# Altium schematic sheet STM32_PLC.SchDoc: STM32_PLC
size 420 x 297 mm; Date: March 14; CheckedBy: ThS. Bùi Quốc Bảo; DrawnBy: Nguyễn Gia Huy; Revision: V1.0; SheetNumber: 3; SheetTotal: 11; MasterProject: STM32-PLC; Sub-system: DA1_prj.PrjPcb
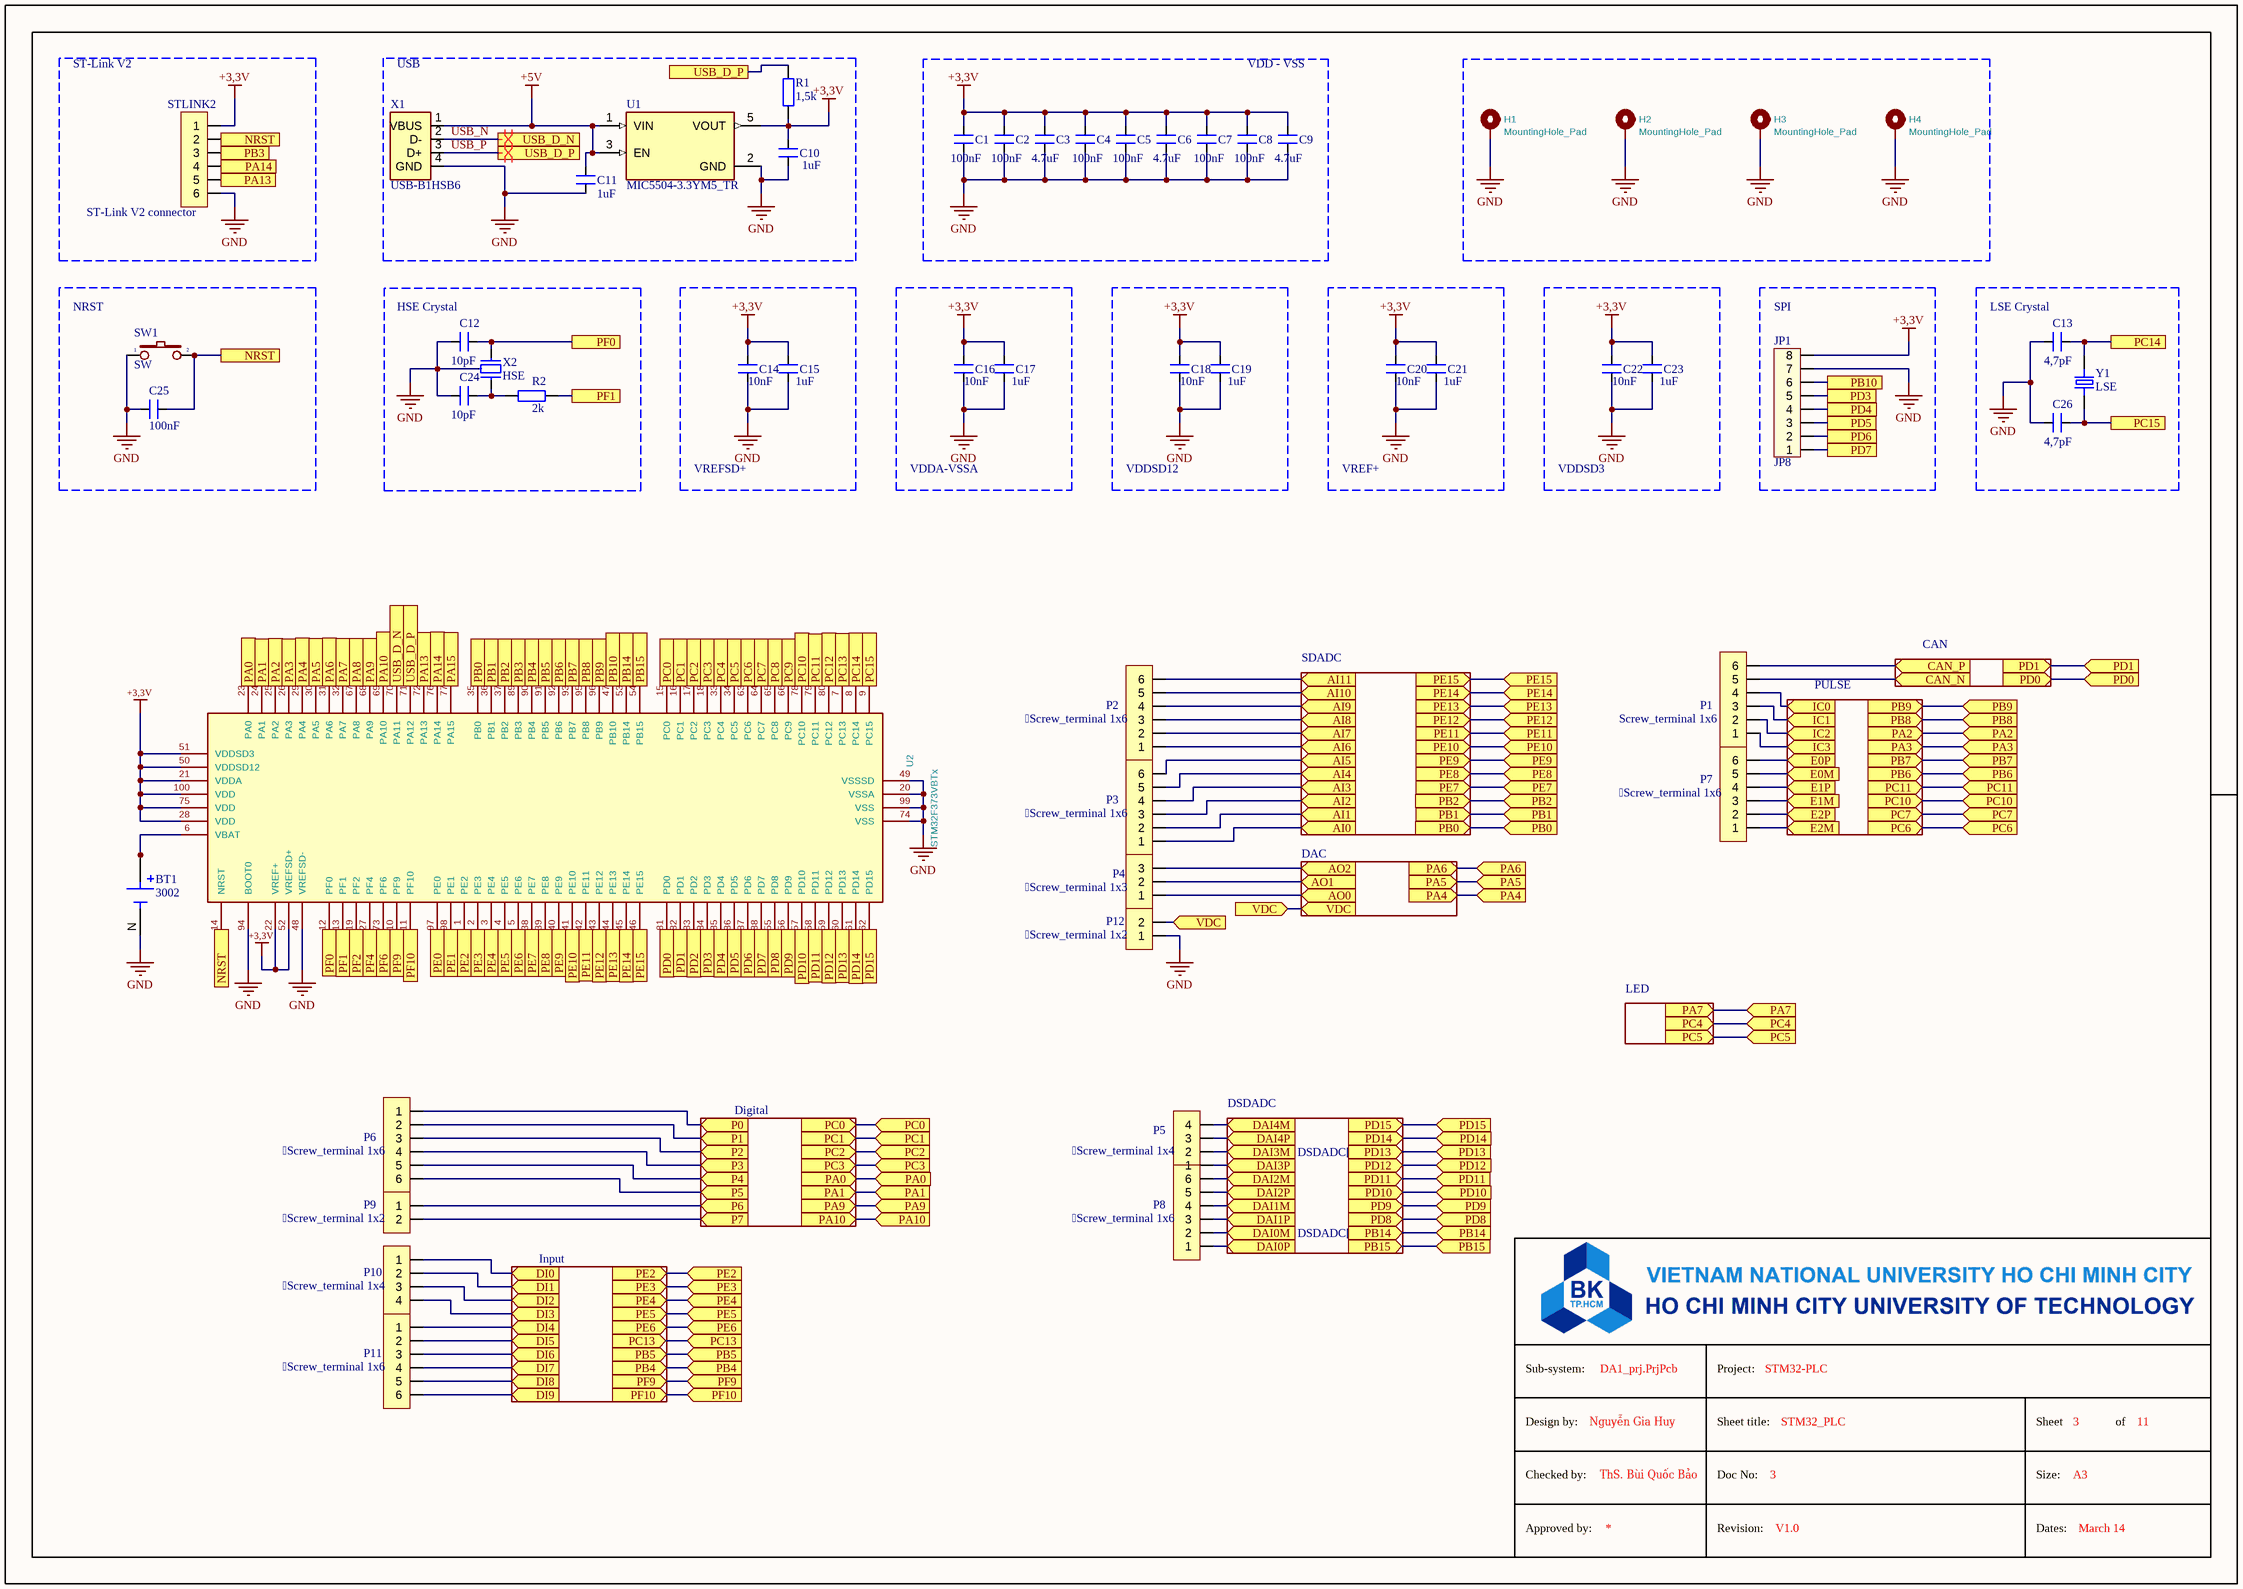
[diagram p0: STM32_PLC.SchDoc]

## Parts
BT1  3002  [BAT_3002]
C1  100nF  [FP-C0603C-CF-IPC_A]
C2  100nF  [FP-C0603C-CF-IPC_A]
C3  4.7uF  [FP-C0603C-CF-IPC_A]
C4  100nF  [FP-C0603C-CF-IPC_A]
C5  100nF  [FP-C0603C-CF-IPC_A]
C6  4.7uF  [FP-C0603C-CF-IPC_A]
C7  100nF  [FP-C0603C-CF-IPC_A]
C8  100nF  [FP-C0603C-CF-IPC_A]
C9  4.7uF  [FP-C0603C-CF-IPC_A]
C10  1uF  [FP-C0603C-CF-IPC_A]
C11  1uF  [FP-C0603C-CF-IPC_A]
C12  10pF  [FP-C0603C-CF-IPC_A]
C13  4,7pF  [FP-C0603C-CF-IPC_A]
C14  10nF  [FP-C0603C-CF-IPC_A]
C15  1uF  [FP-C0603C-CF-IPC_A]
C16  10nF  [FP-C0603C-CF-IPC_A]
C17  1uF  [FP-C0603C-CF-IPC_A]
C18  10nF  [FP-C0603C-CF-IPC_A]
C19  1uF  [FP-C0603C-CF-IPC_A]
C20  10nF  [FP-C0603C-CF-IPC_A]
C21  1uF  [FP-C0603C-CF-IPC_A]
C22  10nF  [FP-C0603C-CF-IPC_A]
C23  1uF  [FP-C0603C-CF-IPC_A]
C24  10pF  [FP-C0603C-CF-IPC_A]
C25  100nF  [FP-C0603C-CF-IPC_A]
C26  4,7pF  [FP-C0603C-CF-IPC_A]
H1  MountingHole_Pad  [MountingHole_2.7mm_M2.5_DIN965_Pad]
H2  MountingHole_Pad  [MountingHole_2.7mm_M2.5_DIN965_Pad]
H3  MountingHole_Pad  [MountingHole_2.7mm_M2.5_DIN965_Pad]
H4  MountingHole_Pad  [MountingHole_2.7mm_M2.5_DIN965_Pad]
JP1  JP8  [HDR/Header/8]
P1  Screw_terminal 1x6  [HDR/Terminal/6]
P2  Screw_terminal 1x6  [HDR/Terminal/6]
P3  Screw_terminal 1x6  [HDR/Terminal/6]
P4  Screw_terminal 1x3  [HDR/Terminal/3]
P5  Screw_terminal 1x4  [HDR/Terminal/4]
P6  Screw_terminal 1x6  [HDR/Terminal/6]
P7  Screw_terminal 1x6  [HDR/Terminal/6]
P8  Screw_terminal 1x6  [HDR/Terminal/6]
P9  Screw_terminal 1x2  [HDR/Terminal/2]
P10  Screw_terminal 1x4  [HDR/Terminal/4]
P11  Screw_terminal 1x6  [HDR/Terminal/6]
P12  Screw_terminal 1x2  [HDR/Terminal/2]
R1  1,5k  [tro smd 0603]
R2  2k  [tro smd 0603]
STLINK2  ST-Link V2 connector  [HDR/Header/6]
SW1  SW  [SW1-SMD]
U1  MIC5504-3.3YM5_TR  [SOT95P280X145-5N]
U2  STM32F373VBTx  [QFP50P1600X1600X160-100N]
X1  USB-B1HSB6  [OST_USB-B1HSB6]
X2  HSE  [XT3]
Y1  LSE  [XTAL_ECS-.327-7-34B-TR]

## Blocks framed on the sheet
ST-Link V2: STLINK2
USB: C10 C11 R1 U1 X1
VDD - VSS: C1-C9
NRST: C25 SW1
HSE Crystal: C12 C24 R2 X2
VREFSD+: C14 C15
VDDA-VSSA: C16 C17
VDDSD12: C18 C19
VREF+: C20 C21
VDDSD3: C22 C23
SPI: JP1
LSE Crystal: C13 C26 Y1

## Ports
AI0 (in, see SDADC[4C]), AI1 (in, see SDADC[4B]), AI2 (in, see SDADC[4B]), AI3 (in, see SDADC[4A]), AI4 (in, see SDADC[3C]), AI5 (in, see SDADC[3B]), AI6 (in, see SDADC[3B]), AI7 (in, see SDADC[3A]), AI8 (in, see SDADC[1C]), AI9 (in, see SDADC[1B]), AI10 (in, see SDADC[1B]), AI11 (in, see SDADC[1A]), AO0 (in, see DAC[3B]), AO1 (in, see DAC[3D]), AO2 (in, see DAC[5B]), CAN_N (in, see CAN[4B]), CAN_P (in, see CAN[4B]), DAI0M (in, see DSDADC[4B]), DAI0P (in, see DSDADC[4A]), DAI1M (in, see DSDADC[3C]), DAI1P (in, see DSDADC[3C]), DAI2M (in, see DSDADC[3A]), DAI2P (in, see DSDADC[3B]), DAI3M (in, see DSDADC[2C]), DAI3P (in, see DSDADC[2C]), DAI4M (in, see DSDADC[2A]), DAI4P (in, see DSDADC[2B]), DI0 (in, see INPUT[1C], INPUT[3D]), DI1 (in, see INPUT[1C], INPUT[3C]), DI2 (in, see INPUT[1C], INPUT[3B]), DI3 (in, see INPUT[1C], INPUT[3B]), DI4 (in, see INPUT[1B], INPUT[3A]), DI5 (in, see INPUT[1B], INPUT[2D]), DI6 (in, see INPUT[1B], INPUT[2C]), DI7 (in, see INPUT[1B], INPUT[2B]), DI8 (in, see INPUT[1B], INPUT[2B]), DI9 (in, see INPUT[1B], INPUT[2A]), E0M (in, see PULSE[3B]), E0P (in, see PULSE[3A]), E1M (in, see PULSE[3C]), E1P (in, see PULSE[3C]), E2M (in, see PULSE[5B]), E2P (in, see PULSE[5A]), IC0 (in, see PULSE[1A]), IC1 (in, see PULSE[1B]), IC2 (in, see PULSE[1C]), IC3 (in, see PULSE[1C]), NRST (in, see STM32_PLC[1A]), NRST (see STM32_PLC[1A], STM32_PLC[1C]), P0 (in, see DIGTITAL[2A]), P1 (in, see DIGTITAL[4B]), P2 (in, see DIGTITAL[4B]), P3 (in, see DIGTITAL[2B]), P4 (in, see DIGTITAL[2B]), P5 (in, see DIGTITAL[5A]), P6 (in, see DIGTITAL[4A]), P7 (in, see DIGTITAL[5B]), PA0 (in, see DIGTITAL[1C], STM32_PLC[1B], STM32_PLC[3C]), PA0 (in, see DIGTITAL[1C], STM32_PLC[3C]), PA1 (in, see DIGTITAL[4A], STM32_PLC[1B], STM32_PLC[3D]), PA1 (in, see DIGTITAL[4A], STM32_PLC[3D]), PA2 (in, see PULSE[2C], STM32_PLC[1B], STM32_PLC[6B]), PA2 (in, see PULSE[2C], STM32_PLC[6B]), PA3 (in, see PULSE[2C], STM32_PLC[1B], STM32_PLC[6B]), PA3 (in, see PULSE[2C], STM32_PLC[6B]), PA4 (in, see DAC[2B], STM32_PLC[1B], STM32_PLC[4C]), PA4 (in, see DAC[2B], STM32_PLC[4C]), PA5 (in, see DAC[2C], STM32_PLC[1B], STM32_PLC[4C]), PA5 (in, see DAC[2C], STM32_PLC[4C]), PA6 (in, see DAC[4B], STM32_PLC[1B], STM32_PLC[4C]), PA6 (in, see DAC[4B], STM32_PLC[4C]), PA7 (in, see LED[3B], STM32_PLC[1B], STM32_PLC[5C]), PA7 (in, see LED[3B], STM32_PLC[5C]), PA8 (in), PA9 (in, see DIGTITAL[3A], STM32_PLC[1B], STM32_PLC[3D]), PA9 (in, see DIGTITAL[3A], STM32_PLC[3D]), PA10 (in, see DIGTITAL[4B], STM32_PLC[2B], STM32_PLC[3D]), PA10 (in, see DIGTITAL[4B], STM32_PLC[3D]), PA13 (in, see STM32_PLC[1A]), PA13 (see STM32_PLC[2B]), PA14 (in, see STM32_PLC[1A]), PA14 (see STM32_PLC[2B]), PA15 (in), PB0 (in, see SDADC[5C], STM32_PLC[2B], STM32_PLC[4C]), PB0 (in, see SDADC[5C], STM32_PLC[2B], STM32_PLC[5C]), PB0 (in, see SDADC[5C], STM32_PLC[4C], STM32_PLC[5C]), PB1 (in, see SDADC[5B], STM32_PLC[2B], STM32_PLC[4C]), PB1 (in, see SDADC[5B], STM32_PLC[2B], STM32_PLC[5C]), PB1 (in, see SDADC[5B], STM32_PLC[4C], STM32_PLC[5C]), PB2 (in, see SDADC[5B], STM32_PLC[2B], STM32_PLC[4C]), PB2 (in, see SDADC[5B], STM32_PLC[2B], STM32_PLC[5C]), PB2 (in, see SDADC[5B], STM32_PLC[4C], STM32_PLC[5C]), PB3 (in, see STM32_PLC[1A]), PB3 (see STM32_PLC[2B]), PB4 (in, see INPUT[3B], STM32_PLC[2B], STM32_PLC[2D]), PB4 (in, see INPUT[3B], STM32_PLC[2D]), PB5 (in, see INPUT[3C], STM32_PLC[2B], STM32_PLC[2D]), PB5 (in, see INPUT[3C], STM32_PLC[2D]), PB6 (in, see PULSE[4B], STM32_PLC[2B], STM32_PLC[6B]), PB6 (in, see PULSE[4B], STM32_PLC[6B]), PB7 (in, see PULSE[4A], STM32_PLC[2B], STM32_PLC[6B]), PB7 (in, see PULSE[4A], STM32_PLC[6B]), PB8 (in, see PULSE[2B], STM32_PLC[2B], STM32_PLC[6B]), PB8 (in, see PULSE[2B], STM32_PLC[6B]), PB9 (in, see PULSE[2A], STM32_PLC[2B], STM32_PLC[6B]), PB9 (in, see PULSE[2A], STM32_PLC[6B]), PB10 (in, see STM32_PLC[5A]), PB10 (see STM32_PLC[2B]), PB14 (in, see DSDADC[5A], STM32_PLC[2B], STM32_PLC[4D]), PB14 (in, see DSDADC[5A], STM32_PLC[4D]), PB15 (in, see DSDADC[5B], STM32_PLC[2B], STM32_PLC[4D]), PB15 (in, see DSDADC[5B], STM32_PLC[4D]), PC0 (in, see DIGTITAL[1A], STM32_PLC[2B], STM32_PLC[3C]), PC0 (in, see DIGTITAL[1A], STM32_PLC[3C]), PC1 (in, see DIGTITAL[3B], STM32_PLC[2B], STM32_PLC[3C]), PC1 (in, see DIGTITAL[3B], STM32_PLC[3C]), PC2 (in, see DIGTITAL[3C], STM32_PLC[2B], STM32_PLC[3C]), PC2 (in, see DIGTITAL[3C], STM32_PLC[3C]), PC3 (in, see DIGTITAL[1B], STM32_PLC[2B], STM32_PLC[3C]), PC3 (in, see DIGTITAL[1B], STM32_PLC[3C]), PC4 (in, see LED[3B], STM32_PLC[2B], STM32_PLC[5C]), PC4 (in, see LED[3B], STM32_PLC[5C]), PC5 (in, see LED[3C], STM32_PLC[2B], STM32_PLC[5C]), PC5 (in, see LED[3C], STM32_PLC[5C]), PC6 (in, see PULSE[6B], STM32_PLC[2B], STM32_PLC[6C]), PC6 (in, see PULSE[6B], STM32_PLC[6C]), PC7 (in, see PULSE[6A], STM32_PLC[3B], STM32_PLC[6C]), PC7 (in, see PULSE[6A], STM32_PLC[6C]), PC8 (in), PC9 (in), PC10 (in, see PULSE[4C], STM32_PLC[3B], STM32_PLC[6C]), PC10 (in, see PULSE[4C], STM32_PLC[6C]), PC11 (in, see PULSE[4C], STM32_PLC[3B], STM32_PLC[6B]), PC11 (in, see PULSE[4C], STM32_PLC[6B]), PC12 (in), PC13 (in, see INPUT[3D], STM32_PLC[2D]), PC13 (in, see INPUT[3D], STM32_PLC[2D], STM32_PLC[3B]), PC14 (in, see STM32_PLC[6A]), PC14 (see STM32_PLC[3B]), PC15 (in, see STM32_PLC[6B]), PC15 (see STM32_PLC[3B]), PD0 (in, see CAN[2C], STM32_PLC[2C], STM32_PLC[6B]), PD0 (in, see CAN[2C], STM32_PLC[6B]), PD1 (in, see CAN[2C], STM32_PLC[2C], STM32_PLC[6B]), PD1 (in, see CAN[2C], STM32_PLC[6B]), PD2 (in), PD3 (in, see STM32_PLC[5A]), PD3 (see STM32_PLC[2C]), PD4 (in, see STM32_PLC[5B]), PD4 (see STM32_PLC[2C]), PD5 (in, see STM32_PLC[5B]), PD5 (see STM32_PLC[2C]), PD6 (in, see STM32_PLC[5B]), PD6 (see STM32_PLC[2C]), PD7 (in, see STM32_PLC[5B]), PD7 (see STM32_PLC[3C]), PD8 (in, see DSDADC[4C], STM32_PLC[3C], STM32_PLC[4D]), PD8 (in, see DSDADC[4C], STM32_PLC[4D]), PD9 (in, see DSDADC[4C], STM32_PLC[3C], STM32_PLC[4D]), PD9 (in, see DSDADC[4C], STM32_PLC[4D]), PD10 (in, see DSDADC[4B], STM32_PLC[3C], STM32_PLC[4D]), PD10 (in, see DSDADC[4B], STM32_PLC[4D]), PD11 (in, see DSDADC[4A], STM32_PLC[3C], STM32_PLC[4C]), PD11 (in, see DSDADC[4A], STM32_PLC[4C]), PD12 (in, see DSDADC[2C], STM32_PLC[3C], STM32_PLC[4C]), PD12 (in, see DSDADC[2C], STM32_PLC[4C]), PD13 (in, see DSDADC[2C], STM32_PLC[3C], STM32_PLC[4C]), PD13 (in, see DSDADC[2C], STM32_PLC[4C]), PD14 (in, see DSDADC[2B], STM32_PLC[3C], STM32_PLC[4C]), PD14 (in, see DSDADC[2B], STM32_PLC[4C]), PD15 (in, see DSDADC[2A], STM32_PLC[3C], STM32_PLC[4C]), PD15 (in, see DSDADC[2A], STM32_PLC[4C]), PE0 (in), PE1 (in), PE2 (in, see INPUT[4D], STM32_PLC[2C], STM32_PLC[2D]), PE2 (in, see INPUT[4D], STM32_PLC[2D]), PE3 (in, see INPUT[4C], STM32_PLC[2C], STM32_PLC[2D]), PE3 (in, see INPUT[4C], STM32_PLC[2D]), PE4 (in, see INPUT[4B], STM32_PLC[2C], STM32_PLC[2D]), PE4 (in, see INPUT[4B], STM32_PLC[2D]), PE5 (in, see INPUT[4B], STM32_PLC[2C], STM32_PLC[2D]), PE5 (in, see INPUT[4B], STM32_PLC[2D]), PE6 (in, see INPUT[4A], STM32_PLC[2C], STM32_PLC[2D]), PE6 (in, see INPUT[4A], STM32_PLC[2D]), PE7 (in, see SDADC[5A], STM32_PLC[2C], STM32_PLC[4B]), PE7 (in, see SDADC[5A], STM32_PLC[2C], STM32_PLC[5B]), PE7 (in, see SDADC[5A], STM32_PLC[4B], STM32_PLC[5B]), PE8 (in, see SDADC[3C], STM32_PLC[2C], STM32_PLC[4B]), PE8 (in, see SDADC[3C], STM32_PLC[2C], STM32_PLC[5B]), PE8 (in, see SDADC[3C], STM32_PLC[4B], STM32_PLC[5B]), PE9 (in, see SDADC[3B], STM32_PLC[2C], STM32_PLC[4B]), PE9 (in, see SDADC[3B], STM32_PLC[2C], STM32_PLC[5B]), PE9 (in, see SDADC[3B], STM32_PLC[4B], STM32_PLC[5B]), PE10 (in, see SDADC[3B], STM32_PLC[2C], STM32_PLC[4B]), PE10 (in, see SDADC[3B], STM32_PLC[2C], STM32_PLC[5B]), PE10 (in, see SDADC[3B], STM32_PLC[4B], STM32_PLC[5B]), PE11 (in, see SDADC[3A], STM32_PLC[2C], STM32_PLC[4B]), PE11 (in, see SDADC[3A], STM32_PLC[2C], STM32_PLC[5B]), PE11 (in, see SDADC[3A], STM32_PLC[4B], STM32_PLC[5B]), PE12 (in, see SDADC[2C], STM32_PLC[2C], STM32_PLC[4B]), PE12 (in, see SDADC[2C], STM32_PLC[2C], STM32_PLC[5B]), PE12 (in, see SDADC[2C], STM32_PLC[4B], STM32_PLC[5B]), PE13 (in, see SDADC[2B], STM32_PLC[2C], STM32_PLC[4B]), PE13 (in, see SDADC[2B], STM32_PLC[2C], STM32_PLC[5B]), PE13 (in, see SDADC[2B], STM32_PLC[4B], STM32_PLC[5B]), PE14 (in, see SDADC[2B], STM32_PLC[2C], STM32_PLC[4B]), PE14 (in, see SDADC[2B], STM32_PLC[2C], STM32_PLC[5B]), PE14 (in, see SDADC[2B], STM32_PLC[4B], STM32_PLC[5B]), PE15 (in, see SDADC[2A], STM32_PLC[2C], STM32_PLC[4B]), PE15 (in, see SDADC[2A], STM32_PLC[2C], STM32_PLC[5B]), PE15 (in, see SDADC[2A], STM32_PLC[4B], STM32_PLC[5B]), PF0 (in, see STM32_PLC[2A]), PF0 (see STM32_PLC[1C]), PF1 (in, see STM32_PLC[2A]), PF1 (see STM32_PLC[1C]), PF2 (in), PF4 (in), PF6 (in), PF9 (in, see INPUT[3B], STM32_PLC[2C], STM32_PLC[2D]), PF9 (in, see INPUT[3B], STM32_PLC[2D]), PF10 (in, see INPUT[3A], STM32_PLC[2C], STM32_PLC[2D]), PF10 (in, see INPUT[3A], STM32_PLC[2D]), USB_D_N (in, see STM32_PLC[2A]), USB_D_N (see STM32_PLC[2B]), USB_D_P (in, see STM32_PLC[2A]), USB_D_P (see STM32_PLC[2A], STM32_PLC[2B]), VDC (in, see DAC[1A], DAC[2A], DAC[3B], DAC[3C], DAC[5B], STM32_PLC[4C])

## Nets
+3,3V: C1.2 C2.2 C3.2 C4.2 C5.2 C6.2 C7.2 C8.2 C9.2 C10.2 C14.2 C15.2 C16.2 C17.2 C18.2 C19.2 C20.2 C21.2 C22.2 C23.2 JP1.8 R1.1 STLINK2.1 U1.5(VOUT) U2.21(VDDA) U2.22(VREF+) U2.28(VDD) U2.50(VDDSD12) U2.51(VDDSD3) U2.52(VREFSD+) U2.75(VDD) U2.100(VDD)
+5V: C11.2 U1.1(VIN) U1.3(EN) X1.1(VBUS)
GND: BT1.N(NEG) C1.1 C2.1 C3.1 C4.1 C5.1 C6.1 C7.1 C8.1 C9.1 C10.1 C11.1 C12.2 C13.2 C14.1 C15.1 C16.1 C17.1 C18.1 C19.1 C20.1 C21.1 C22.1 C23.1 C24.2 C25.2 C26.2 H1.1 H2.1 H3.1 H4.1 JP1.7 P12.1 STLINK2.6 SW1.1 U1.2(GND) U2.20(VSSA) U2.48(VREFSD-) U2.49(VSSSD) U2.74(VSS) U2.94(BOOT0) U2.99(VSS) X1.4(GND) X2.3
AI0: P3.1 ; port AI0
AI1: P3.2 ; port AI1
AI2: P3.3 ; port AI2
AI3: P3.4 ; port AI3
AI4: P3.5 ; port AI4
AI5: P3.6 ; port AI5
AI6: P2.1 ; port AI6
AI7: P2.2 ; port AI7
AI8: P2.3 ; port AI8
AI9: P2.4 ; port AI9
AI10: P2.5 ; port AI10
AI11: P2.6 ; port AI11
AO0: P4.1 ; port AO0
AO1: P4.2 ; port AO1
AO2: P4.3 ; port AO2
CAN_N: P1.5 ; port CAN_N
CAN_P: P1.6 ; port CAN_P
DAI0M: P8.2 ; port DAI0M
DAI0P: P8.1 ; port DAI0P
DAI1M: P8.4 ; port DAI1M
DAI1P: P8.3 ; port DAI1P
DAI2M: P8.6 ; port DAI2M
DAI2P: P8.5 ; port DAI2P
DAI3M: P5.2 ; port DAI3M
DAI3P: P5.1 ; port DAI3P
DAI4M: P5.4 ; port DAI4M
DAI4P: P5.3 ; port DAI4P
DI0: P10.1 ; port DI0
DI1: P10.2 ; port DI1
DI2: P10.3 ; port DI2
DI3: P10.4 ; port DI3
DI4: P11.1 ; port DI4
DI5: P11.2 ; port DI5
DI6: P11.3 ; port DI6
DI7: P11.4 ; port DI7
DI8: P11.5 ; port DI8
DI9: P11.6 ; port DI9
E0M: P7.5 ; port E0M
E0P: P7.6 ; port E0P
E1M: P7.3 ; port E1M
E1P: P7.4 ; port E1P
E2M: P7.1 ; port E2M
E2P: P7.2 ; port E2P
IC0: P1.4 ; port IC0
IC1: P1.3 ; port IC1
IC2: P1.2 ; port IC2
IC3: P1.1 ; port IC3
NRST: C25.1 STLINK2.2 SW1.2 U2.14(NRST) ; port NRST
P0: P6.1 ; port P0
P1: P6.2 ; port P1
P2: P6.3 ; port P2
P3: P6.4 ; port P3
P4: P6.5 ; port P4
P5: P6.6 ; port P5
P6: P9.1 ; port P6
P7: P9.2 ; port P7
PA0: U2.23(PA0) ; port PA0
PA1: U2.24(PA1) ; port PA1
PA2: U2.25(PA2) ; port PA2
PA3: U2.26(PA3) ; port PA3
PA4: U2.29(PA4) ; port PA4
PA5: U2.30(PA5) ; port PA5
PA6: U2.31(PA6) ; port PA6
PA7: U2.32(PA7) ; port PA7
PA8: U2.67(PA8) ; port PA8
PA9: U2.68(PA9) ; port PA9
PA10: U2.69(PA10) ; port PA10
PA13: STLINK2.5 U2.72(PA13) ; port PA13
PA14: STLINK2.4 U2.76(PA14) ; port PA14
PA15: U2.77(PA15) ; port PA15
PB0: U2.35(PB0) ; port PB0
PB1: U2.36(PB1) ; port PB1
PB2: U2.37(PB2) ; port PB2
PB3: STLINK2.3 U2.89(PB3) ; port PB3
PB4: U2.90(PB4) ; port PB4
PB5: U2.91(PB5) ; port PB5
PB6: U2.92(PB6) ; port PB6
PB7: U2.93(PB7) ; port PB7
PB8: U2.95(PB8) ; port PB8
PB9: U2.96(PB9) ; port PB9
PB10: JP1.6 U2.47(PB10) ; port PB10
PB14: U2.53(PB14) ; port PB14
PB15: U2.54(PB15) ; port PB15
PC0: U2.15(PC0) ; port PC0
PC1: U2.16(PC1) ; port PC1
PC2: U2.17(PC2) ; port PC2
PC3: U2.18(PC3) ; port PC3
PC4: U2.33(PC4) ; port PC4
PC5: U2.34(PC5) ; port PC5
PC6: U2.63(PC6) ; port PC6
PC7: U2.64(PC7) ; port PC7
PC8: U2.65(PC8) ; port PC8
PC9: U2.66(PC9) ; port PC9
PC10: U2.78(PC10) ; port PC10
PC11: U2.79(PC11) ; port PC11
PC12: U2.80(PC12) ; port PC12
PC13: U2.7(PC13) ; port PC13
PC14: C13.1 U2.8(PC14) Y1.2 ; port PC14
PC15: C26.1 U2.9(PC15) Y1.1 ; port PC15
PD0: U2.81(PD0) ; port PD0
PD1: U2.82(PD1) ; port PD1
PD2: U2.83(PD2) ; port PD2
PD3: JP1.5 U2.84(PD3) ; port PD3
PD4: JP1.4 U2.85(PD4) ; port PD4
PD5: JP1.3 U2.86(PD5) ; port PD5
PD6: JP1.2 U2.87(PD6) ; port PD6
PD7: JP1.1 U2.88(PD7) ; port PD7
PD8: U2.55(PD8) ; port PD8
PD9: U2.56(PD9) ; port PD9
PD10: U2.57(PD10) ; port PD10
PD11: U2.58(PD11) ; port PD11
PD12: U2.59(PD12) ; port PD12
PD13: U2.60(PD13) ; port PD13
PD14: U2.61(PD14) ; port PD14
PD15: U2.62(PD15) ; port PD15
PE0: U2.97(PE0) ; port PE0
PE1: U2.98(PE1) ; port PE1
PE2: U2.1(PE2) ; port PE2
PE3: U2.2(PE3) ; port PE3
PE4: U2.3(PE4) ; port PE4
PE5: U2.4(PE5) ; port PE5
PE6: U2.5(PE6) ; port PE6
PE7: U2.38(PE7) ; port PE7
PE8: U2.39(PE8) ; port PE8
PE9: U2.40(PE9) ; port PE9
PE10: U2.41(PE10) ; port PE10
PE11: U2.42(PE11) ; port PE11
PE12: U2.43(PE12) ; port PE12
PE13: U2.44(PE13) ; port PE13
PE14: U2.45(PE14) ; port PE14
PE15: U2.46(PE15) ; port PE15
PF0: C12.1 U2.12(PF0) X2.1 ; port PF0
PF1: R2.1 U2.13(PF1) ; port PF1
PF2: U2.19(PF2) ; port PF2
PF4: U2.27(PF4) ; port PF4
PF6: U2.73(PF6) ; port PF6
PF9: U2.10(PF9) ; port PF9
PF10: U2.11(PF10) ; port PF10
USB_N: U2.70(PA11) X1.2(D-) ; port USB_D_N
USB_P: R1.2 U2.71(PA12) X1.3(D+) ; port USB_D_P
VDC: P12.2 ; port VDC
NetBT1_P1: BT1.P1(POS) BT1.P2(POS) U2.6(VBAT)
NetC24_1: C24.1 R2.2 X2.2

## Layout directives
differential pair: USB_N, USB_P

## Notes on the sheet
- SDADC
- CAN
- PULSE
- DAC
- LED
- Digital
- (near P5) DSDADC
- Input
- Sub-system:
- Project:
- Design by:
- Sheet title:
- Sheet
- of
- Checked by:
- Approved by:
- Doc No:
- Revision:
- Size:
- Dates:
- A3

## Library data of the parts
BT1 = 3002: Battery Holder: SMT, 1 Coin Cell, 20mm, PhosBronze/Tin-Nickel | Keystone Electronics 3002; MF: Keystone Electronics Corp.; SnapEDA_Link: https://www.snapeda.com/parts/3002/Keystone/view-part/?ref=snap; Package: NON STANDARD-2 Keystone; Value: *; MP: 3002; Check_prices: https://www.snapeda.com/parts/3002/Keystone/view-part/?ref=eda
C1-C26 = CN-SEMI-DIP: Capacitor (Semiconductor SIM Model); Value: 104; LatestRevisionDate: 17-Jul-2002; LatestRevisionNote: Re-released for DXP Platform.; PackageReference: C1206; Publisher: Altium Limited
JP1 = Header8: Connector 8; Value: Connector 8
P1-P3 P6-P8 P11 STLINK2 = Header 6: Header, 6-Pin
P4 = Header 3: Header, 3-Pin
P5 P10 = Header 4: Header, 4-Pin
P9 P12 = Header 2: Header, 2-Pin
R1 R2 = Tro 0603 1% 10k: RES; Chung_Loai: Dán; Don_Vi: Con; So_Chan: 2; Ten_Linh_Kien: Trở 0603 1% 10k; Ma_Hang: MH006333; Kieu_Chan: *
SW1 = SW2: Switch button 2 pin; Value: SW chip 2 pin
U1 = MIC5504-3.3YM5_TR: Linear Voltage Regulator IC Positive Fixed 1 Output 300mA SOT-23-5; MF: Microchip; MP: MIC5504-3.3YM5 TR; SnapEDA_Link: https://www.snapeda.com/parts/MIC5504-3.3YM5%20TR/Microchip/view-part/?ref=snap; Package: SOT-23 Microchip; Value: *; Check_prices: https://www.snapeda.com/parts/MIC5504-3.3YM5%20TR/Microchip/view-part/?ref=eda
X1 = USB-B1HSB6: USB-B (USB TYPE-B) - Receptacle Connector 4 Position Through Hole, Right Angle; MF: On Shore; Check_prices: https://www.snapeda.com/parts/USB-B1HSB6/On+Shore+Technology+Inc./view-part/?ref=eda; Value: *; Purchase-URL: https://pricing.snapeda.com/search/part/USB-B1HSB6/?ref=eda; Price: None; MP: USB-B1HSB6; SnapEDA_Link: https://www.snapeda.com/parts/USB-B1HSB6/On+Shore+Technology+Inc./view-part/?ref=snap; Availability: In Stock; Package: None
X2 = XT3: Crystal For all Crystal 2pin.; Value: 4Mhz
Y1 = ECS-.327-7-34B-TR: 32.768 kHz Â±20ppm Crystal 7pF 70 kOhms 2-SMD, No Lead; MF: ECS Inc.; SnapEDA_Link: https://www.snapeda.com/parts/ECS-.327-7-34B-TR/ECS/view-part/?ref=snap; Package: ECX-31B-34B-2 ECS; Value: *; MP: ECS-.327-7-34B-TR; Check_prices: https://www.snapeda.com/parts/ECS-.327-7-34B-TR/ECS/view-part/?ref=eda
H1-H4 = MountingHole_Pad: Value: MountingHole_Pad; Footprint: MountingHole:MountingHole_2.7mm_M2.5_DIN965_Pad
U2 = STM32F373VBTx: Value: STM32F373VBTx; Footprint: Package_QFP:LQFP-100_14x14mm_P0.5mm